# EAGLE design TAG_connect-iso (EAGLE 6.3)
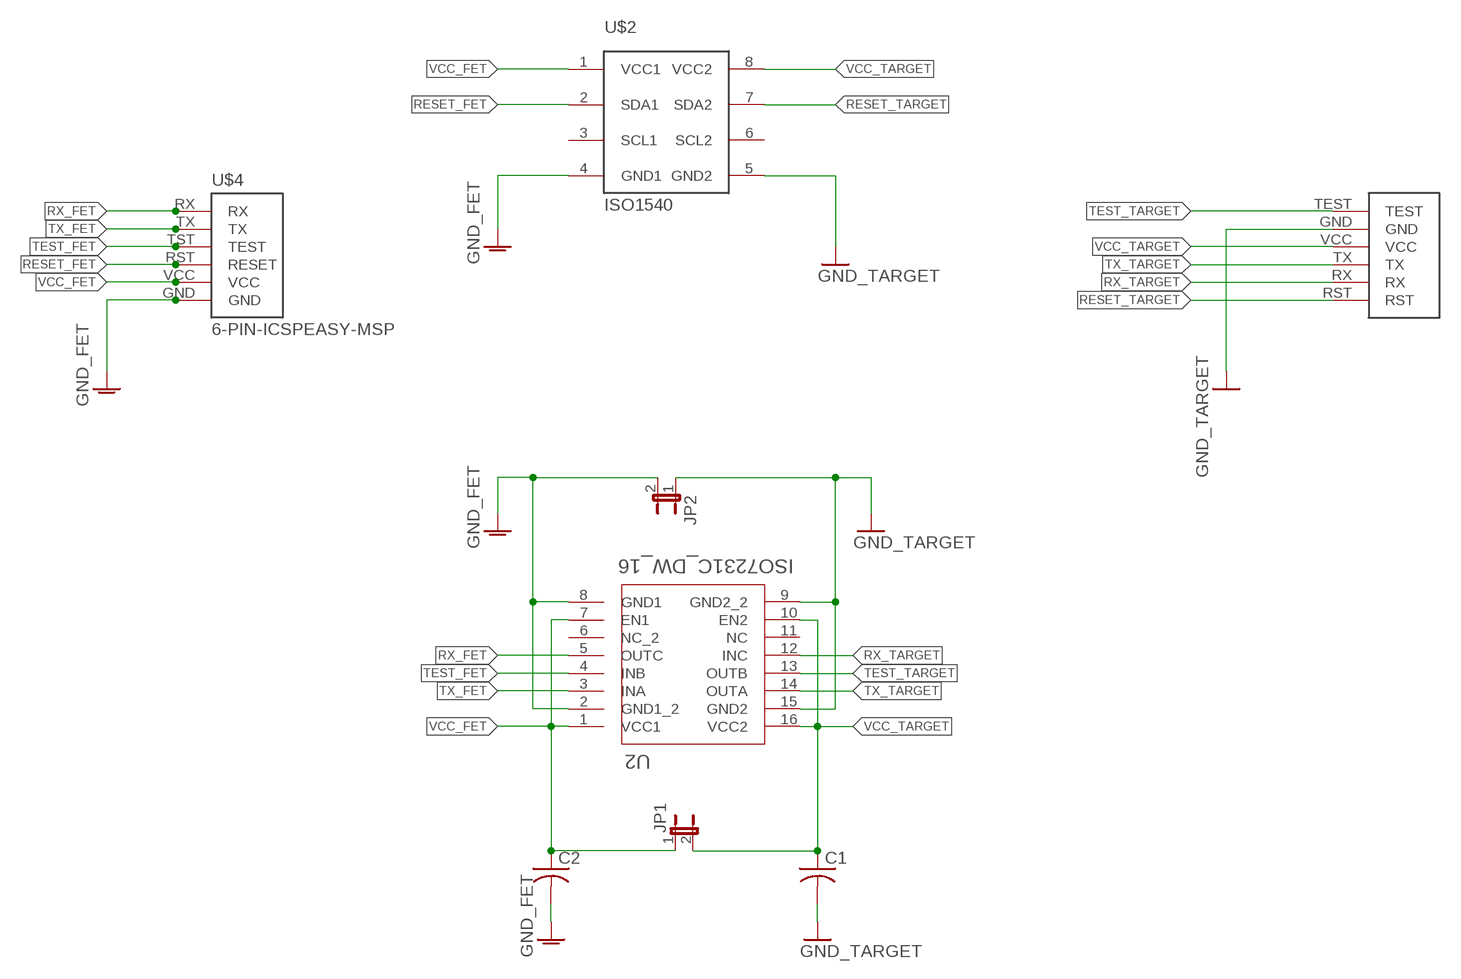
[diagram p0: schematic, sheet 1]

## Parts
C1  C-USC1206  [C1206]
C2  C-USC1206  [C1206]
JP1  JUMPER-2PTH_LOCK  [1X02_LOCK]
JP2  JUMPER-2PTH_LOCK  [1X02_LOCK]
U2  ISO7231C_DW_16  [DW16]
U$1  RJ-12SMD  [MOLEX_RJ45_SMD]
U$2  ISO1540  [D8]
U$4  6-PIN-ICSPEASY-MSP  [EASYMSP-6PIN]

## Nets
GND_FET: C2.2 JP2.2 U2.2(GND1_2) U2.8(GND1) U$2.4(GND1) U$4.GND
GND_TARGET: C1.2 JP2.1 U2.9(GND2_2) U2.15(GND2) U$1.GND U$2.5(GND2)
RESET_FET: U$2.2(SDA1) U$4.RST(RESET)
RESET_TARGET: U$1.RST U$2.7(SDA2)
RX_FET: U2.5(OUTC) U$4.RX
RX_TARGET: U2.12(INC) U$1.RX
TEST_FET: U2.4(INB) U$4.TST(TEST)
TEST_TARGET: U2.13(OUTB) U$1.TEST
TX_FET: U2.3(INA) U$4.TX
TX_TARGET: U2.14(OUTA) U$1.TX
VCC_FET: C2.1 JP1.1 U2.1(VCC1) U2.7(EN1) U$2.1(VCC1) U$4.VCC
VCC_TARGET: C1.1 JP1.2 U2.10(EN2) U2.16(VCC2) U$1.VCC U$2.8(VCC2)
Unconnected: U2.6(NC_2) U2.11(NC) U$2.3(SCL1) U$2.6(SCL2)

## Library data of the parts
C1 C2 = adafruit:C-US: CAPACITOR, American symbol
JP1 JP2 = SparkFun-Passives:JUMPER-2: Jumper Basic 0.1" spaced jumper. Use with breakaway headers.
U2 = TI:ISO7231C_DW_16; DATASHEETURL: http://www.ti.com/lit/gpn/ISO7231C; DESCRIPTION: Triple Channel, 2/1, 25Mbps, Digital Isolator; FAMILY_NAME: ISOLATOR; GENERIC_PART_NUMBER: ISO7231C; INDUSTRY_STD_PKG_TYPE: SOIC; MANUFACTURER: Texas Instruments; MANUFACTURER_PART_NUMBER: iso7231c_dw_16; PACKAGE_DESIGNATOR: DW; PIN_COUNT: 16; VENDOR: Texas Instruments
U$1 = LaunchFET:RJ-12; MODEL: 95501-6669
U$2 = TI:ISO1540
U$4 = LaunchFET:6-PIN-ICSP: 6 pin easy-msp formatted headers. Designed to make programming target boards with MSP430 Launchpad easier. EASYMSP: standard .05" pitch header to match launchpad SAFEMSP: .05" header with .025" offset Vcc to keep Geordi away

## Board
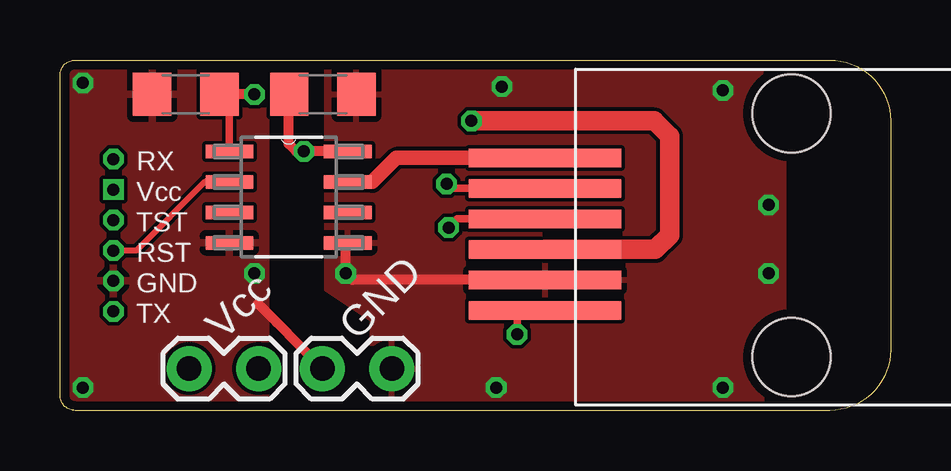
[diagram p1: board, top side]
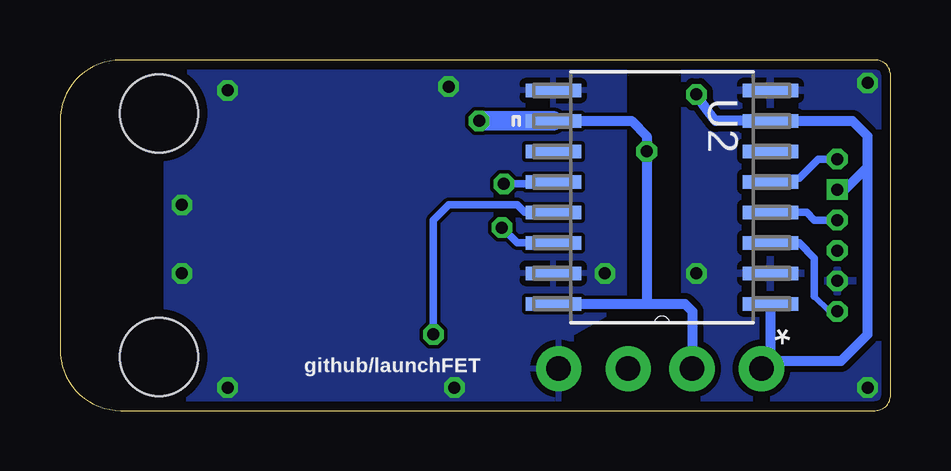
[diagram p2: board, bottom side, seen from below]

Size 34.61 x 14.61 mm. Coordinates in mm from the lower left corner, seen from the top.
Outline: 34.61,12.07 34.61,2.54 arc-90 32.07,0 0.64,0 arc-90 0,0.64 0,13.97 arc-90 0.64,14.61 32.07,14.61 arc-90 34.61,12.07
Copper layers (1*16): Top 0.0356mm / dielectric 1.5011mm / Bottom 0.0356mm
Design rules "LaenPCBOrder *": minimum track width 6mil, minimum drill 13mil, track to track 6mil, track to pad 6mil, pad to pad 6mil, via to via 6mil, smd to smd 6mil, copper to edge 15mil, drill to drill 6mil, minimum pad ring 7mil, minimum via ring 7mil, stop-mask expansion 4mil, vias tented up to drill 20mil, thermal gap 10mil

### Footprints (pad centres in the part's own frame; a part is rotated, then mirrored left to right if it is on the bottom)
C1206 = smd 1.6 x 1.8: 1 -1.4,0; 2 1.4,0
1X02_LOCK = drill 1.016 pad 1.88: 1 -0.178,0; 2 2.718,0
DW16 = smd 2.311 x 0.559: 1 -4.521,4.445; 2 -4.521,3.175; 3 -4.521,1.905; 4 -4.521,0.635; 5 -4.521,-0.635; 6 -4.521,-1.905; 7 -4.521,-3.175; 8 -4.521,-4.445; 9 4.521,-4.445; 10 4.521,-3.175; 11 4.521,-1.905; 12 4.521,-0.635; 13 4.521,0.635; 14 4.521,1.905; 15 4.521,3.175; 16 4.521,4.445
MOLEX_RJ45_SMD = smd 0.76 x 6.35: GND 3.22,10.27; RST 8.3,10.27; RX 7.03,10.27; TEST 1.95,10.27; TX 5.76,10.27; VCC 4.49,10.27 | hole 3.25: 0,0; 10.16,0
D8 = smd 1.981 x 0.559: 1 -2.464,1.905; 2 -2.464,0.635; 3 -2.464,-0.635; 4 -2.464,-1.905; 5 2.464,-1.905; 6 2.464,-0.635; 7 2.464,0.635; 8 2.464,1.905
EASYMSP-6PIN = drill 0.5 octagon: GND 0,-1.27; RST 0,0; RX 0,3.81; TST 0,1.27; TX 0,-2.54 | drill 0.5 square: VCC 0,2.54

### Placement (x,y rotation side)
C1  10.95,13.18 0 top
C2  5.24,13.18 180 top
JP1  5.56,1.75 0 top
JP2  13.65,1.75 180 top
U2  9.52,8.89 180 bottom
U$1  30.48,2.22 90 top
U$2  9.52,8.89 0 top
U$4  2.22,6.67 0 top

### Tracks (layer width: path | path; a pad name or v marks a point on that pad's centre or on a via)
GND_FET  (via drill 0.5)
  Top 0.406: JP2.2 9.03,3.67 8.25,4.45
  other vias: 0.95,0.95 0.95,13.65 8.1,5.71
  pour Top: 8.57,0 0,0 0,14.61 8.57,14.61
  pour Bottom (isolate 0.254): 0,14.61 8.57,14.61 8.57,0 0,0
GND_TARGET  (via drill 0.5)
  Top 0.406: U$1.GND 12.18,5.44 v11.91,5.71 11.91,6.9 U$2.5
  other vias: 27.62,13.33 27.62,0.95 29.53,8.57 29.53,5.71 18.41,13.49 18.18,0.95
  pour Bottom: 11.11,14.61 11.11,4.45 13.34,3.18 13.34,0 30.16,0 30.16,14.61
  pour Top: 11.11,14.61 11.11,5.08 13.02,3.81 13.02,0 30.16,0 30.16,14.61
RESET_FET
  Top 0.254: U$2.2 6.03,9.53 3.17,6.67 U$4.RST
RESET_TARGET
  Top 0.305: U$2.7 13.02,9.53
  Top 0.61: U$1.RST 14.02,10.52 13.02,9.53
RX_FET
  Bottom 0.305: U2.5 4.85,9.68 3.81,9.68 3.02,10.48 U$4.RX
RX_TARGET  (via drill 0.5)
  Top 0.305: U$1.RX 16.31,9.25 v16.11,9.45
  Bottom 0.305: v16.11,9.45 14.13,9.45 U2.12
TEST_FET
  Bottom 0.305: U2.4 3.49,8.25 3.17,7.94 U$4.TST
TEST_TARGET  (via drill 0.5)
  Top 0.305: v19.05,3.18 19.05,4.13 20.16,4.13 U$1.TEST
  Bottom 0.305: U2.13 15.24,8.25 15.56,8.57 18.41,8.57 19.05,7.94 v19.05,3.18
TX_FET
  Bottom 0.254: 2.54,4.13 3.17,4.76
  Bottom 0.305: 3.17,4.76 3.17,6.35 3.81,6.99 U2.3 | U$4.TX 2.54,4.13
TX_TARGET  (via drill 0.5)
  Top 0.305: U$1.TX 16.56,7.98 v16.19,7.62
  Bottom 0.305: v16.19,7.62 15.56,6.99 U2.14
VCC_FET  (via drill 0.5)
  Top 0.305: U$2.1 7.06,12.75 C2.1
  Top 0.406: v8.1,13.18 C2.1
  Bottom 0.305: U2.1 5,2.12 | 5,2.15 4.92,2.06
  Bottom 0.406: 0.95,10.16 1.9,9.21 U$4.VCC | 0.95,10.16 0.95,11.43 1.59,12.07 U2.7 7.3,12.07 7.78,12.7 v8.1,13.18 | 5,2.12 JP1.1 | U2.1 5,2.15 | 4.92,2.06 2.06,2.06 0.95,3.18 0.95,10.16
VCC_TARGET  (via drill 0.5)
  Top 0.406: C1.1 9.52,13.15 9.52,11.11 9.84,10.79 v10.16,10.79 U$2.8 12.7,10.79
  Top 0.813: U$1.VCC 24.81,6.71 25.4,7.3 25.4,11.43 24.77,12.07 v17.14,12.07
  Bottom 0.406: U2.16 10.16,4.45 | 10.16,4.45 8.57,4.45 8.25,4.13 8.25,1.77 JP1.2 | U2.10 10.79,12.07 10.16,11.43 v10.16,10.79 10.16,4.45
  Bottom 0.813: v17.14,12.07 U2.10

### Text on the board
tStop: LaunchFET
_tsilk: Vcc | GND
_bsilk: github/launchFET